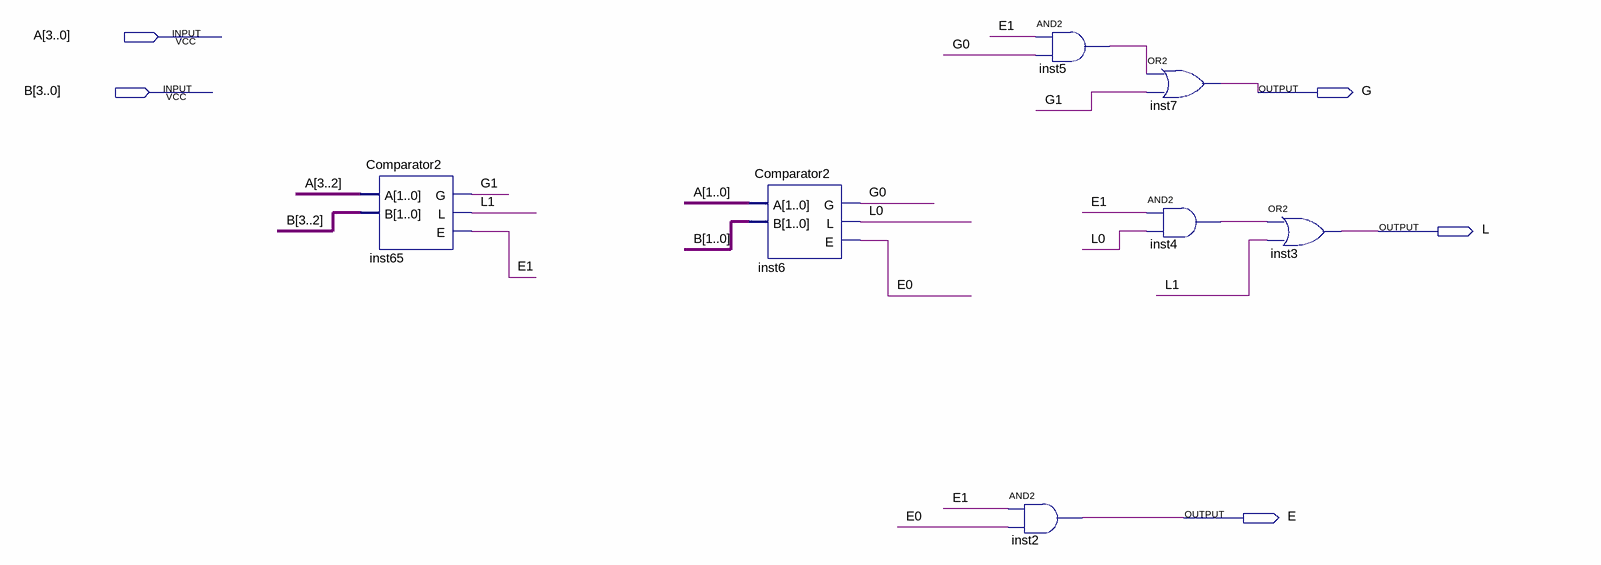
[diagram p0: schematic sheet]
// Quartus schematic Comparator4.bdf as structural Verilog: 7 symbols, 5 pins
module Comparator4 (
  input  [3:0] A,
  input  [3:0] B,
  output G,
  output L,
  output E
);

  wire E0, E1, G0, G1, inst4_out, inst5_out, L0, L1;

  Comparator2 inst65 (.A(A[3:2]), .B(B[3:2]), .G(G1), .L(L1), .E(E1));
  Comparator2 inst6 (.A(A[1:0]), .B(B[1:0]), .G(G0), .L(L0), .E(E0));
  and inst5 (inst5_out, E1, G0);
  and inst2 (E, E1, E0);
  or inst7 (G, inst5_out, G1);
  and inst4 (inst4_out, E1, L0);
  or inst3 (L, inst4_out, L1);
endmodule
